# EAGLE design Adafruit 0.56 7-Segment QT (EAGLE 9.6.2)
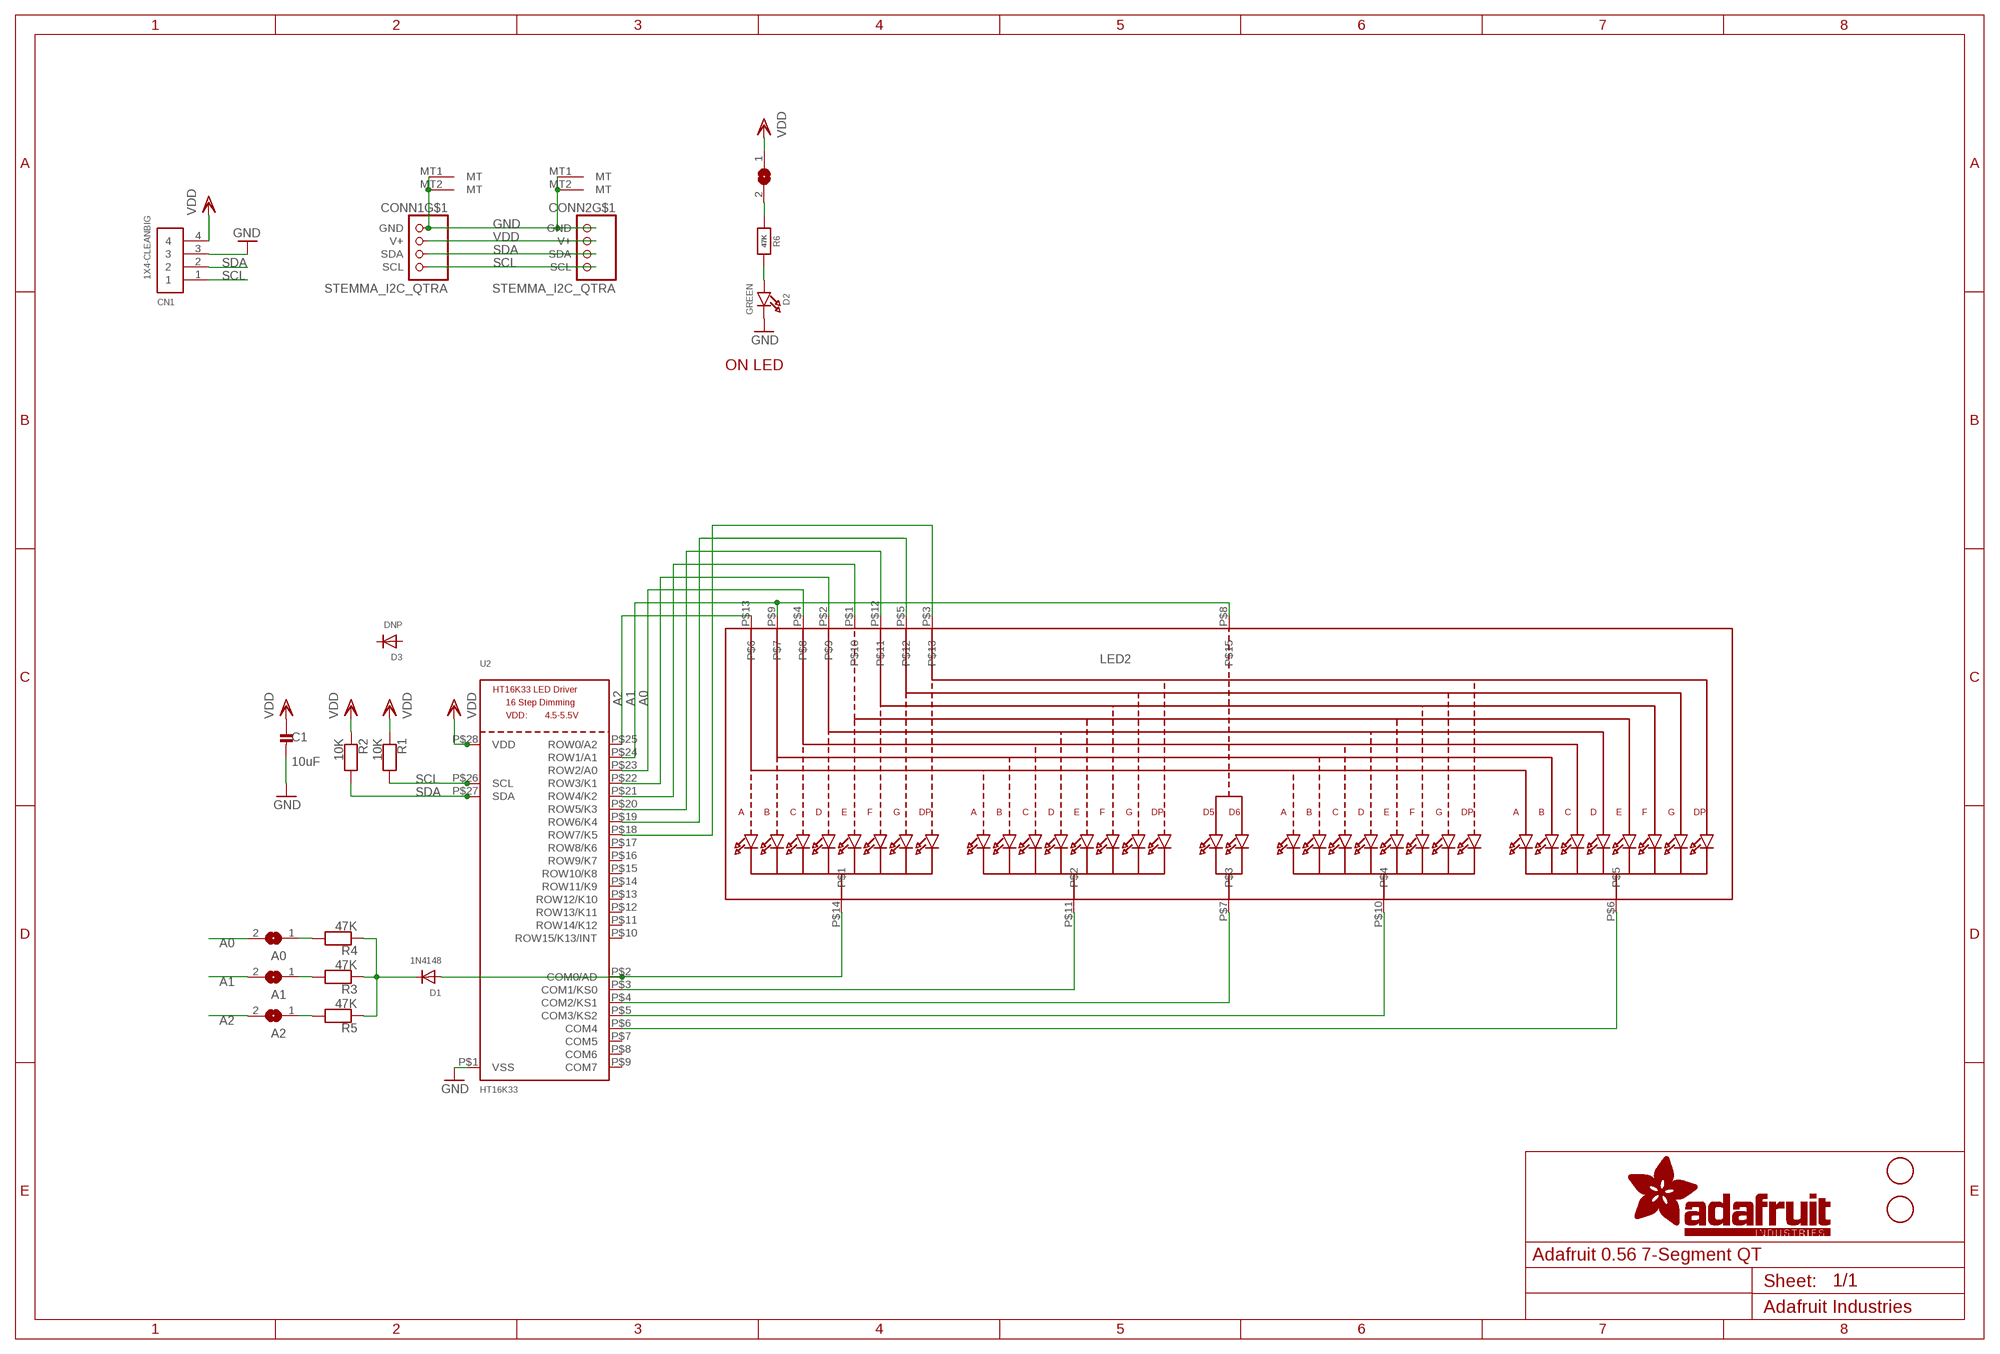
[diagram p0: schematic, sheet 1]

## Parts
A0  SOLDERJUMPER  [SOLDERJUMPER_ARROW_NOPASTE]
A1  SOLDERJUMPER  [SOLDERJUMPER_ARROW_NOPASTE]
A2  SOLDERJUMPER  [SOLDERJUMPER_ARROW_NOPASTE]
C1  10uF  CAP_CERAMIC0805_10MGAP  [0805_10MGAP]
CN1  1X4-CLEANBIG  [1X04-CLEANBIG]
CONN1  STEMMA_I2C_QTRA  [JST_SH4_RA]
CONN2  STEMMA_I2C_QTRA  [JST_SH4_RA]
D1  1N4148  DIODESOD-323F  [SOD-323F]
D2  GREEN  LED0603_NOOUTLINE  [CHIPLED_0603_NOOUTLINE]
D3  DNP  DIODESOD-323F  [SOD-323F]
LED2  DISP_SEGMENT_4DIGIT_BL-Q56C43  [SEGMENT-BL-Q56C43]
LEDJMP  SOLDERJUMPERCLOSED  [SOLDERJUMPER_CLOSEDWIRE]
R1  10K  RESISTOR_0603_NOOUT  [0603-NO]
R2  10K  RESISTOR_0603_NOOUT  [0603-NO]
R3  47K  RESISTOR_0603_NOOUT  [0603-NO]
R4  47K  RESISTOR_0603_NOOUT  [0603-NO]
R5  47K  RESISTOR_0603_NOOUT  [0603-NO]
R6  47K  RESISTOR_0603_NOOUT  [0603-NO]
U2  HT16K33  HT16K33_SOP28_SKINNY  [SOP28_300MIL_SKINNY]
U$1  FIDUCIAL  [FIDUCIAL_1MM]
U$2  FIDUCIAL  [FIDUCIAL_1MM]

## Nets
A0: A0.2 LED2.P$4 U2.P$23(ROW2/A0)
A1: A1.2 LED2.P$8 LED2.P$9 U2.P$24(ROW1/A1)
A2: A2.2 LED2.P$13 U2.P$25(ROW0/A2)
GND: C1.2 CN1.3 CONN1.1(GND) CONN1.MT1(MT) CONN1.MT2(MT) CONN2.1(GND) CONN2.MT1(MT) CONN2.MT2(MT) D2.C U2.P$1(VSS)
N$1: D1.C R3.1 R4.1 R5.1
N$2: D1.A LED2.P$14 U2.P$2(COM0/AD)
N$3: LED2.P$11 U2.P$3(COM1/KS0)
N$4: LED2.P$7 U2.P$4(COM2/KS1)
N$5: LED2.P$10 U2.P$5(COM3/KS2)
N$6: LED2.P$6 U2.P$6(COM4)
N$7: A2.1 R5.2
N$8: D2.A R6.2
N$9 [lowpower]: LEDJMP.2 R6.1
N$10: LED2.P$2 U2.P$22(ROW3/K1)
N$11: LED2.P$1 U2.P$21(ROW4/K2)
N$12: LED2.P$12 U2.P$20(ROW5/K3)
N$13: LED2.P$5 U2.P$19(ROW6/K4)
N$16: LED2.P$3 U2.P$18(ROW7/K5)
N$19: A1.1 R3.2
N$20: A0.1 R4.2
SCL: CN1.1 CONN1.4(SCL) CONN2.4(SCL) R1.2 U2.P$26(SCL)
SDA: CN1.2 CONN1.3(SDA) CONN2.3(SDA) R2.2 U2.P$27(SDA)
VDD: C1.1 CN1.4 CONN1.2(V+) CONN2.2(V+) LEDJMP.1 R1.1 R2.1 U2.P$28(VDD)
Unconnected: D3.A D3.C U2.P$7(COM5) U2.P$8(COM6) U2.P$9(COM7) U2.P$10(ROW15/K13/INT) U2.P$11(ROW14/K12) U2.P$12(ROW13/K11) U2.P$13(ROW12/K10) U2.P$14(ROW11/K9) U2.P$15(ROW10/K8) U2.P$16(ROW9/K7) U2.P$17(ROW8/K6)

## Notes on the sheet
- ON LED

## Library data of the parts
A0 A1 A2 = microbuilder:SOLDERJUMPER: SMD Solder JUMPER Solder the two pads together to create a connection, or remove the solder to break it. REFLOW - Use this footprint for solder paste and reflow ovens. WAVE - Use this footprint for hand-soldering (larger pads). CLOSED - Has a trace between the two pads to ensure it is closed by default. The trace needs to be cut to disable the jumper, and can be closed again by creating a solder bridge between the two pads.; BOM: EXCLUDE
C1 = microbuilder:CAP_CERAMIC: Ceramic Capacitors For new designs, use the packages preceded by an '_' character since they are more reliable: The following footprints should be used on most boards: _0402 - Standard footprint for regular board layouts _0603 - Standard footprint for regular board layouts _0805 - Standard footprint for regular board layouts _1206 - Standard footprint for regular board layouts For extremely tight-pitch boards where space is at a premium, the following 'micro-pitch' footprints can be used (smaller pads, no silkscreen outline, etc.): _0402MP - Micro-pitch footprint for very dense/compact boards _0603MP - Micro-pitch footprint for very dense/compact boards _0805MP - Micro-pitch footprint for very dense/compact boards _1206MP - Micro-pitch footprint for very dense/compact boards
CN1 = adafruit:1X4: 4-pin connector
CONN1 CONN2 = microbuilder:STEMMA_I2C
D1 D3 = adafruit:DIODE: Diode SMADIODE - SMA Surface Mount Package 20V 1A Schottky Diode Digikey: 641-1014-6-ND DO-1N4148 - Through Hole Small Current Diode SOD-123 20V 1 A (.5mV Vf) Schottky Diode - Digikey: MBRX120TPMSCT-ND SOD-323 10V 570mA (.38mV Vf, 3ns) Schottky Diode - Digikey: ZLLS410CT-ND SOD-523 30V 30mA Schottky Diode (RB751S-40TE61) - Digikey: RB751S-40TE61CT-ND SOT23-R/W - SOT23 Package (R = Solder Paste/Reflow Ovens, W = Hand-Soldering) BAT54Film 40V 300mA - Digikey: 497-7162-1-ND
D2 = microbuilder:LED: LED 0603 - 0603 Surface Mount Package 2mA: Green LED - Low Power (3.9mcd, 2ma, 1.7Vf) - Digikey: 475-2709-2-ND Orange LED - Low Power (9.8mcd, 2ma, 1.8Vf) - Digikey: 475-1194-2-ND Red LED - Low Power (5mcd, 2ma, 1.8Vf) - Digikey: 475-1195-2-ND Yellow LED - Low Power (7mcd, 2ma, 1.8Vf) - Digikey: 475-1196-2-ND 5mA: Blue LED - Low Power (17mcd, 5ma, 2.9Vf) - Digikey: LNJ937W8CRACT-ND 0805 - 0805 Surface Mount Package 2mA: Red LED (8.8mcd, 2mA, 1.8Vf, Clear) - Low Power [Digikey: 475-2510-1-ND] Green LED (5mcd, 2mA, 1.8Vf, Clear) - Low Power [Digikey: 475-2730-1-ND] Yellow LED (11.3mcd, 2mA, 1.8Vf, Clear) - Low Power [Digikey: 475-2555-1-ND] 20mA: Red LED (104mcd, 20mA, Diffused) - LS R976 [Digikey: 475-1278-6-ND] Red LED (12mcd, 20mA, 2.0Vf, Clear) - APT2012EC [Digikey: 754-1128-1-ND] Green LED (15mcd, 20mA, 2.2Vf, Clear) - APT2012GC [Digikey: 754-1131-1-ND] Orange LED (160mcd, 20mA, 2.1Vf, Clear) - APT2012SECK [Digikey: 754-1130-1-ND] 1206 - 1206 Surface Mount Package Green LED (26mcd, 20mA, Diffused) - LG N971 [Digikey: 475-1407-6-ND] Red LED (15mcd, 20mA, Diffused) - LH N974 [Digikey: 475-1416-6-ND] Cree - Cree High-Power Surface Mount LEDs XPEBWT-L1-0000-00D50 - White 111lm 350mA 2.9Vf 6200K 110° XTEAWT-00-0000-00000LEE3 - White 114lm 350mA 2.85Vf 5000K 115° Everlight - Everlight 45-21 Series Surface Mount LEDs 45-21/QK2C-B2832AC2CB2/2T - Warm White 2000mcd 20mA 3.25Vf 3050K 120° 45-21/LK2C-B38452C4CB2/2T - Nuetral White 2000mcd 20mA 3.25Vf 4150K 120° 45-21/LK2C-B50634C6CB2/2T - Cold White 2200mcd 20mA 3.25Vf 5650K 120° PLCC2 Reverse Mount LS T77K-J1L2-1-0-2-R18-Z - Red 11.25mcd 2mA 1.8Vf 630nm 120° LO T77K-L1M2-24-Z - Orange 19.6mcd 2mA 1.8Vf 606nm 120° LY T77K-K2M1-26-Z - Yellow 15.7mcd 2mA 1.8Vf 587nm 120°
LED2 = adafruit_display:DISP_SEGMENT_4DIGIT_BL-Q56C43
LEDJMP = microbuilder:SOLDERJUMPER: SMD Solder JUMPER Solder the two pads together to create a connection, or remove the solder to break it. REFLOW - Use this footprint for solder paste and reflow ovens. WAVE - Use this footprint for hand-soldering (larger pads). CLOSED - Has a trace between the two pads to ensure it is closed by default. The trace needs to be cut to disable the jumper, and can be closed again by creating a solder bridge between the two pads.
R1-R6 = microbuilder:RESISTOR: Resistors For new designs, use the packages preceded by an '_' character since they are more reliable: The following footprints should be used on most boards: _0402 - Standard footprint for regular board layouts _0603 - Standard footprint for regular board layouts _0805 - Standard footprint for regular board layouts _1206 - Standard footprint for regular board layouts For extremely tight-pitch boards where space is at a premium, the following 'micro-pitch' footprints can be used (smaller pads, no silkscreen outline, etc.): _0402MP - Micro-pitch footprint for very dense/compact boards _0603MP - Micro-pitch footprint for very dense/compact boards _0805MP - Micro-pitch footprint for very dense/compact boards _1206MP - Micro-pitch footprint for very dense/compact boards
U2 = adafruit_display:HT16K33_SOP28
U$1 U$2 = adafruit:FIDUCIAL: For use by pick and place machines to calibrate the vision/machine, 1mm By microbuilder.eu

## Net classes
1 highpower: width 0.305 mm, drill 0.483 mm
2 lowpower: width 0.254 mm, drill 0.483 mm

## Board
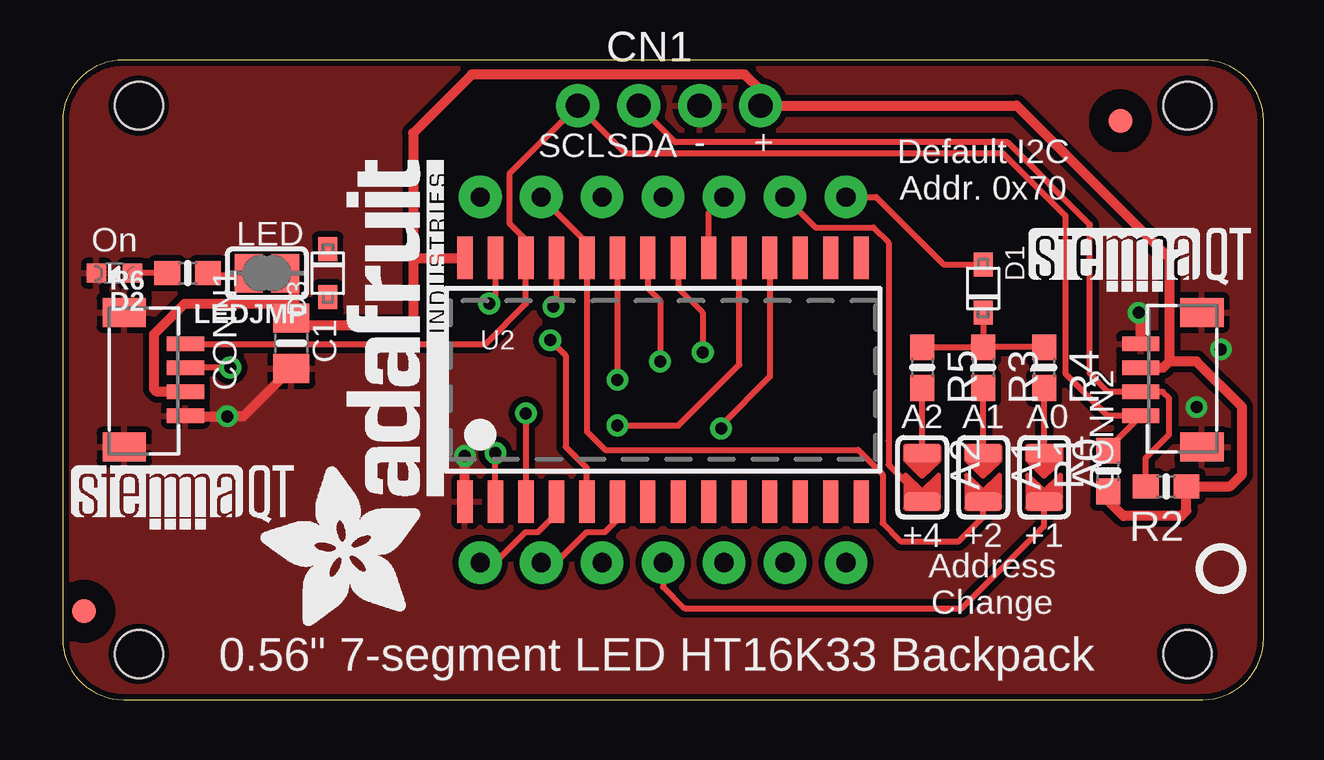
[diagram p1: board, top side]
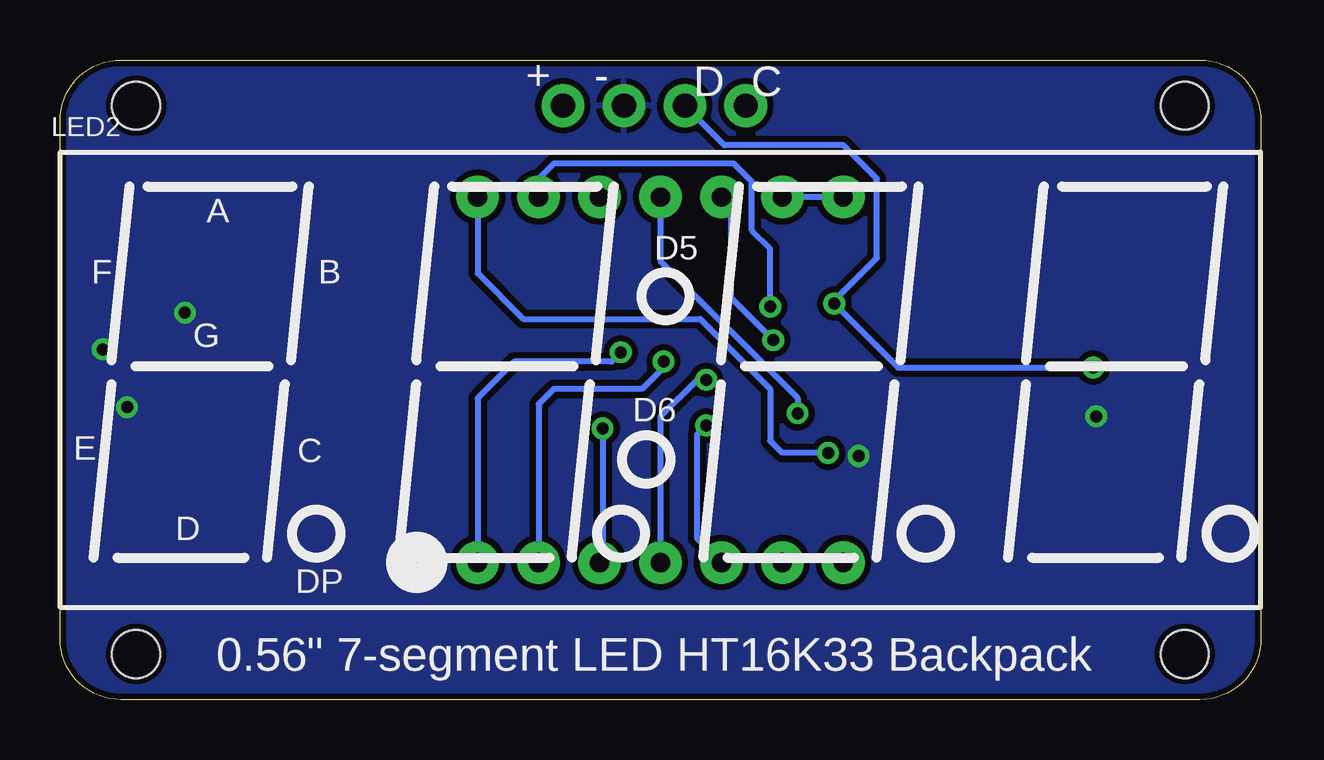
[diagram p2: board, bottom side, seen from below]

Size 50.04 x 26.67 mm. Coordinates in mm from the lower left corner, seen from the top.
Outline: 47.5,0 arc90 50.04,2.54 50.04,24.13 arc90 47.5,26.67 2.54,26.67 arc90 0,24.13 0,2.54 arc90 2.54,0 47.5,0
Copper layers (1*16): Top 0.035mm / dielectric 1.5mm / Bottom 0.035mm
Design rules "default": minimum track width 8mil, minimum drill 15mil, track to track 8mil, track to pad 8mil, pad to pad 8mil, via to via 8mil, smd to smd 8mil, copper to edge 1mil, drill to drill 8mil, minimum pad ring 10mil, minimum via ring 8mil, stop-mask expansion 4mil, vias tented up to drill 20mil, thermal gap 10mil
Holes 2 mm at 3.17,1.91 46.86,1.91 3.17,24.77 46.86,24.77

### Footprints (pad centres in the part's own frame; a part is rotated, then mirrored left to right if it is on the bottom)
SOLDERJUMPER_ARROW_NOPASTE = smd 0.762 x 1.524: 1 -1.016,0; 2 1.016,0
0805_10MGAP = smd 1.2 x 1.5: 1 -1.05,0; 2 1.05,0
1X04-CLEANBIG = drill 1.016 pad 1.778: 1 -3.81,0; 2 -1.27,0; 3 1.27,0; 4 3.81,0
JST_SH4_RA = smd 0.6 x 1.55: 1 1.5,1.686; 2 0.5,1.686; 3 -0.5,1.686; 4 -1.5,1.686 | smd 1.2 x 1.8: MT1 -2.8,-0.862; MT2 2.8,-0.862
SOD-323F = smd 1 x 0.8: A -1,0; C 1,0
CHIPLED_0603_NOOUTLINE = smd 0.8 x 0.8: A 0,-0.75; C 0,0.75
SEGMENT-BL-Q56C43 = drill 0.8 pad 1.778: P$1 -7.62,-7.62; P$2 -5.08,-7.62; P$3 -2.54,-7.62; P$4 0,-7.62; P$5 2.54,-7.62; P$6 5.08,-7.62; P$7 7.62,-7.62; P$8 7.62,7.62; P$9 5.08,7.62; P$10 2.54,7.62; P$11 0,7.62; P$12 -2.54,7.62; P$13 -5.08,7.62; P$14 -7.62,7.62
SOLDERJUMPER_CLOSEDWIRE = smd 1.168 x 1.6: 1 -0.762,0; 2 0.762,0 | smd 0.635 x 0.203: WIRE 0,0
0603-NO = smd 1.075 x 1: 1 -0.85,0; 2 0.85,0
SOP28_300MIL_SKINNY = smd 0.635 x 1.778: P$1 -8.255,-5.08; P$2 -6.985,-5.08; P$3 -5.715,-5.08; P$4 -4.445,-5.08; P$5 -3.175,-5.08; P$6 -1.905,-5.08; P$7 -0.635,-5.08; P$8 0.635,-5.08; P$9 1.905,-5.08; P$10 3.175,-5.08; P$11 4.445,-5.08; P$12 5.715,-5.08; P$13 6.985,-5.08; P$14 8.255,-5.08; P$15 8.255,5.08; P$16 6.985,5.08; P$17 5.715,5.08; P$18 4.445,5.08; P$19 3.175,5.08; P$20 1.905,5.08; P$21 0.635,5.08; P$22 -0.635,5.08; P$23 -1.905,5.08; P$24 -3.175,5.08; P$25 -4.445,5.08; P$26 -5.715,5.08; P$27 -6.985,5.08; P$28 -8.255,5.08
FIDUCIAL_1MM = smd 1 x 1: 1 0,0

### Placement (x,y rotation side)
A0  40.89,9.27 270 top
A1  38.35,9.27 270 top
A2  35.81,9.27 270 top
C1  9.52,14.86 270 top
CN1  25.27,24.77 0 top
CONN1  3.43,13.34 270 top
CONN2  46.61,13.34 90 top
D1  38.35,17.14 270 top
D2  2.16,17.78 90 top
D3  11.05,17.78 90 top
LED2  25.02,13.34 0 bottom
LEDJMP  8.51,17.78 180 top
R1  43.56,9.53 90 top
R2  45.97,8.89 180 top
R3  38.35,13.84 270 top
R4  40.89,13.84 270 top
R5  35.81,13.84 270 top
R6  5.21,17.78 180 top
U2  25.02,13.34 0 top
U$1  44.07,24.13 0 top
U$2  0.89,3.68 0 top
U$3  [ADAFRUIT_TEXT_20MM]  15.87,2.92 90 top
U$5  [STEMMAQT]  0.38,7.11 0 top
U$6  [STEMMAQT]  40.26,17.02 0 top
U$7  [PCBFEAT-REV-040]  48.26,5.46 0 top

### Tracks (layer width: path | path; a pad name or v marks a point on that pad's centre or on a via)
A0  (via drill 0.5)
  Top 0.254: U2.P$23 v23.11,13.34 | LED2.P$4 25.02,4.7 25.91,3.81 37.46,3.81 40.89,7.24 A0.2
  Bottom 0.254: LED2.P$4 25.02,11.81 23.49,13.34 v23.11,13.34
A1
  Top 0.254: LED2.P$9 21.84,19.05 U2.P$24 21.84,11.18 22.61,10.41 33.15,10.41 34.16,9.4 34.16,7.37 34.92,6.6 37.34,6.6 38.35,7.62 A1.2
  Bottom 0.254: LED2.P$8 LED2.P$9
A2  (via drill 0.5)
  Top 0.254: U2.P$25 20.57,16.51 v20.45,16.38 | LED2.P$13 31.37,19.69 33.78,19.69 34.42,19.05 34.42,10.8 34.42,9.79 35.81,8.39 A2.2
  Bottom 0.254: v20.45,16.38 20.45,18.8 21.21,19.56 21.21,21.59 21.97,22.35 29.46,22.35 30.1,21.72 LED2.P$13
GND  (via drill 0.5)
  Top 0.406: U2.P$1 v16.76,10.16 | CONN1.1 5.14,11.81 v6.86,11.81 7.53,11.81 C1.2 | CONN2.1 44.92,16.04 v44.83,16.13
  other vias: 47.24,12.19 48.26,14.61
  pour Bottom (isolate 0.254): -0.38,26.67 -0.38,0 50.16,0 50.16,26.67
  pour Top (isolate 0.254): -0.38,26.67 -0.38,0 50.16,0 50.16,26.67
N$1
  Top 0.254: R5.1 37.85,14.69 | 37.85,14.69 R3.1 R4.1 | D1.C 38.35,15.2 37.85,14.69
N$2  (via drill 0.5)
  Top 0.254: U2.P$2 v18.03,10.29 | LED2.P$14 33.89,20.96 36.7,18.14 D1.A
  Bottom 0.254: LED2.P$14 32.64,17.78 30.73,15.88 23.37,15.88 20.45,12.95 20.45,10.8 19.94,10.29 v18.03,10.29
N$3  (via drill 0.5)
  Top 0.254: v19.3,11.94 U2.P$3
  Bottom 0.254: LED2.P$11 25.02,18.29 19.3,12.57 v19.3,11.94
N$4
  Top 0.254: LED2.P$7 18.03,5.72 19.3,6.99 19.81,6.99 20.57,7.75 U2.P$4
N$5  (via drill 0.5)
  Top 0.254: U2.P$5 21.84,9.65 20.95,10.54 20.95,14.35 v20.32,14.99
  Bottom 0.254: v20.32,14.99 22.1,16.76 22.1,20.57 LED2.P$10
N$6
  Top 0.254: LED2.P$6 20.57,5.72 21.84,6.99 22.61,6.99 23.11,7.49 U2.P$6
N$7
  Top 0.254: A2.1 R5.2
N$8
  Top 0.254: R6.2 D2.A
N$9
  Top 0.254: LEDJMP.2 6.31,17.65 R6.1
N$10  (via drill 0.5)
  Top 0.254: U2.P$22 24.38,17.14 24.89,16.64 v24.89,14.1
  Bottom 0.254: v24.89,14.1 24.89,13.84 25.78,12.95 29.46,12.95 30.1,12.32 LED2.P$2
N$11  (via drill 0.5)
  Top 0.254: U2.P$21 25.65,17.14 26.67,16.13 v26.67,14.48
  Bottom 0.254: v26.67,14.48 27.05,14.1 31.11,14.1 32.64,12.57 LED2.P$1
N$12
  Top 0.254: U2.P$20 26.92,20.32 LED2.P$12
N$13  (via drill 0.5)
  Top 0.254: v23.11,11.43 25.65,11.43 28.19,13.97 U2.P$19
  Bottom 0.254: LED2.P$5 23.49,6.73 23.49,11.05 v23.11,11.43
N$16  (via drill 0.5)
  Top 0.254: U2.P$18 29.46,13.46 27.43,11.43 v27.43,11.3
  Bottom 0.254: v27.43,11.3 27.43,5.84 LED2.P$3
N$19
  Top 0.254: A1.1 R3.2
N$20
  Top 0.254: A0.1 R4.2
SCL
  Top 0.254: R1.2 43.59,10.5 CONN2.4 43.54,11.84 41.78,13.59 41.78,20.18 39.18,22.78 23.44,22.78 CN1.1 18.62,21.92 18.62,19.86 19.3,19.18 U2.P$26 19.3,16.51 17.63,14.84 CONN1.4
SDA  (via drill 0.5)
  Top 0.254: R2.2 45.12,10.07 46.1,11.05 46.1,12.57 45.84,12.84 CONN2.3 43.55,12.84 42.8,13.59 42.8,19.81 39.37,23.24 25.53,23.24 CN1.2 | U2.P$27 18.03,16.76 v17.78,16.51 | v6.98,13.84 CONN1.3
  Bottom 0.254: v17.78,16.51 17.72,16.45 | 17.72,16.45 15.11,13.84 v6.98,13.84 | 17.72,16.45 17.72,16.7 16,18.41 16,21.72 17.4,23.11 22.35,23.11 CN1.2
VDD
  Top 0.254: LEDJMP.1 9.52,17.53 | 9.52,17.78 9.52,17.53 | 9.52,17.53 9.52,16.51
  Top 0.406: CONN1.2 3.93,12.84 3.81,12.95 3.81,15.24 5.08,16.51 9.52,16.51 | 9.52,17.78 9.65,17.78 9.65,16.26 9.65,16.04 | 14.6,18.41 U2.P$28 | 14.6,18.41 14.6,23.62 17.04,26.06 28.42,26.06 29.08,25.4 CN1.4 39.75,24.77 46.1,18.41 46.1,14.1 | 14.6,18.41 14.6,15.62 9.65,15.62 9.65,16.04 | CONN2.2 45.84,13.84 46.1,14.1 | R1.1 43.56,8.29 44.2,7.66 46.61,7.66 46.82,7.87 R2.1 48.64,8.89 49.15,9.4 49.15,12.19 47.24,14.1 46.1,14.1 | 9.65,16.04 C1.1

### Text on the board
tPlace: SCL | SDA | - | + | Default I2C / Addr. 0x70 | On | LED | A2 | A1 | A0 | +4 | +2 | +1 | Address / Change | 0.56" 7-segment LED HT16K33 Backpack
bPlace: C | D | - | + | 0.56" 7-segment LED HT16K33 Backpack
bDocu: SCL | VCC | GND | SDA | A2 | A1 | A0